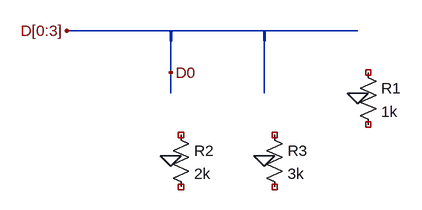
[diagram p0: schematic bus_tap.asc]
bus_tap.asc, the LTspice schematic file:
Version 4
SHEET 1 880 680
WIRE 96 96 544 96
WIRE 256 112 256 192
WIRE 400 112 400 192
FLAG 96 96 D[0:3]
FLAG 256 160 D0
FLAG 544 192 0
FLAG 256 288 0
FLAG 400 288 0
BUSTAP 256 96 256 112
BUSTAP 400 96 400 112
SYMBOL res 544 144 R0
SYMATTR InstName R1
SYMATTR Value 1k
SYMBOL res 256 240 R0
SYMATTR InstName R2
SYMATTR Value 2k
SYMBOL res 400 240 R0
SYMATTR InstName R3
SYMATTR Value 3k

The netlist it stands for:
* bus_tap.asc
R1 NC_01 NC_02 1k
R2 NC_03 NC_04 2k
R3 NC_05 NC_06 3k
.backanno
.end